# EAGLE board Power_Supply (EAGLE 6.5.0), part 1 of 2
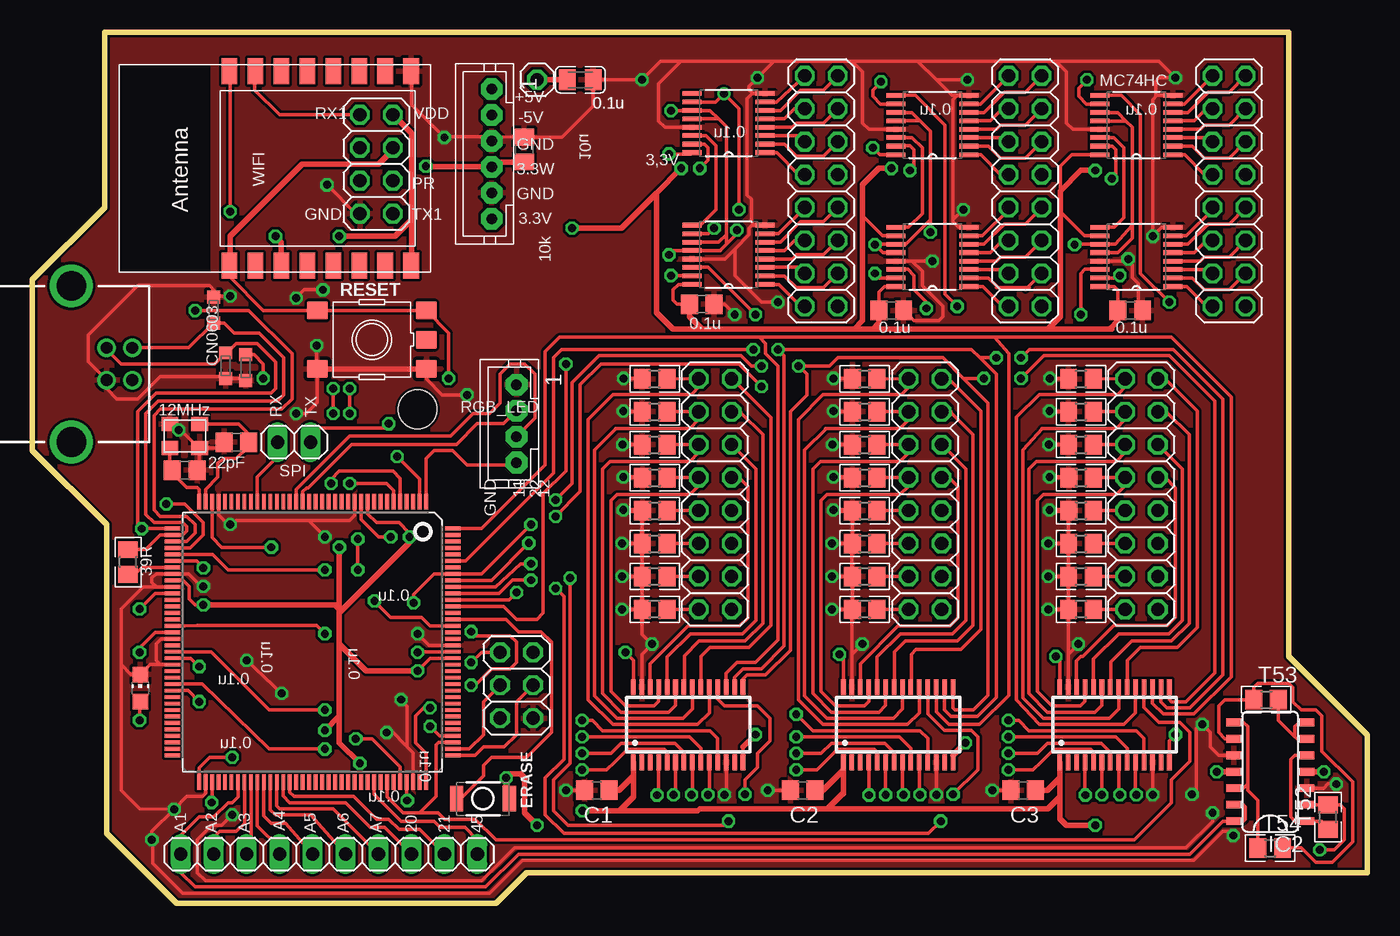
[diagram p5: board, top side]
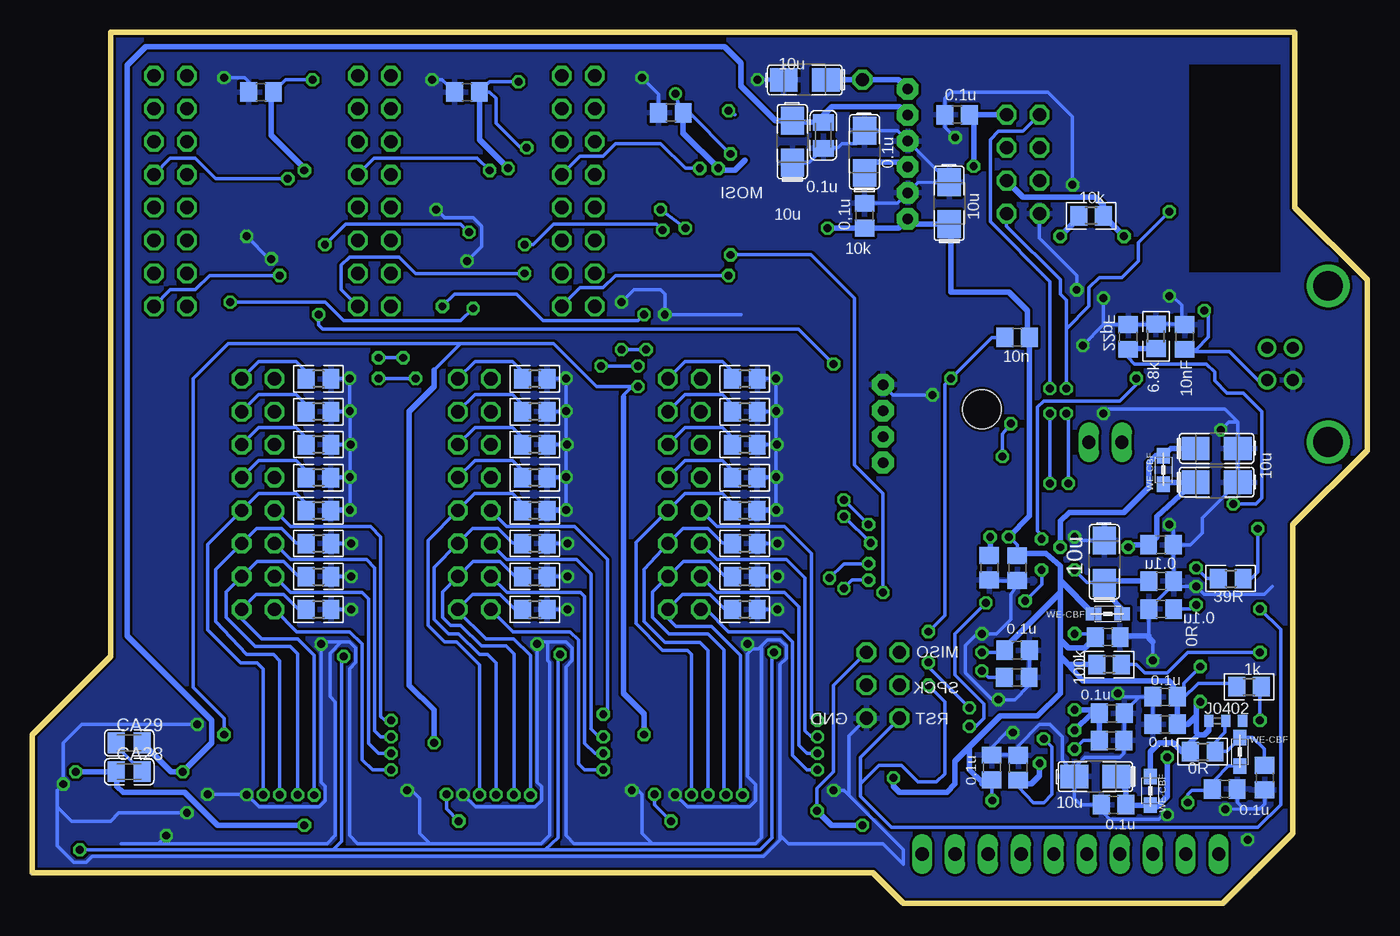
[diagram p6: board, bottom side, seen from below]

Size 102.87 x 67.15 mm. Coordinates in mm from the lower left corner, seen from the top.
Outline: 96.84,67.15 5.56,67.15 5.56,53.66 0,48.1 0,34.92 5.71,29.21 5.71,5.4 11.11,0 35.72,0 38.1,2.38 102.87,2.38 102.87,13.02 96.84,19.05 96.84,67.15
Copper layers (1*16): Top 0.035mm / dielectric 1.6mm / Bottom 0.035mm
Design rules "default *": minimum track width 10mil, minimum drill 24mil, track to track 8mil, track to pad 8mil, pad to pad 8mil, via to via 8mil, smd to smd 8mil, copper to edge 8mil, drill to drill 8mil, minimum pad ring 10mil, minimum via ring 8mil, stop-mask expansion 4mil, vias tented up to drill 0mil, thermal gap 10mil
Net classes: 1 USB: width 0.203 mm, drill 0.254 mm, clearance 0.203 mm; 2 gnd1: width 0.203 mm, drill 0.254 mm, clearance 0.203 mm; 3 usbvcc: width 0.203 mm, drill 0.254 mm, clearance 0.203 mm; 4 USBpair: width 0.203 mm, drill 0.254 mm, clearance 0.203 mm; 5 UA1: width 0.127 mm, drill 0.254 mm, clearance 0.127 mm
Holes 3 mm at 29.69,38.1

## Footprints (pad centres in the part's own frame; a part is rotated, then mirrored left to right if it is on the bottom)
J0402 = smd 0.7 x 0.9: 1 -0.65,0; 2 0.65,0; 3 1.95,0
C0805 = smd 1.3 x 1.5: 1 -0.95,0; 2 0.95,0
B/3528-21W = smd 2.15 x 1.8: + 1.625,0; - -1.625,0
C0805K = smd 1.3 x 1.6: 1 -1,0; 2 1,0
SMD_157SW = smd 1.016 x 1.981: 1 -2.032,0; 2 2.032,0
SO014 = smd 0.6 x 1.2: 1 -3.175,-2.8; 2 -1.905,-2.8; 3 -0.635,-2.8; 4 0.635,-2.8; 5 1.905,-2.8; 6 3.175,-2.8; 7 4.445,-2.8; 8 4.445,2.8; 9 3.175,2.8; 10 1.905,2.8; 11 0.635,2.8; 12 -0.635,2.8; 13 -1.905,2.8; 14 -3.175,2.8
2X08 = drill 1.016 octagon: 1 -8.89,-1.27; 2 -8.89,1.27; 3 -6.35,-1.27; 4 -6.35,1.27; 5 -3.81,-1.27; 6 -3.81,1.27; 7 -1.27,-1.27; 8 -1.27,1.27; 9 1.27,-1.27; 10 1.27,1.27; 11 3.81,-1.27; 12 3.81,1.27; 13 6.35,-1.27; 14 6.35,1.27; 15 8.89,-1.27; 16 8.89,1.27
1X10 = drill 1.016 long: 1 -11.43,0; 2 -8.89,0; 3 -6.35,0; 4 -3.81,0; 5 -1.27,0; 6 1.27,0; 7 3.81,0; 8 6.35,0; 9 8.89,0; 10 11.43,0
1X02 = drill 1.016 long: 1 -1.27,0; 2 1.27,0
2X03 = drill 1.016 octagon: 1 -2.54,-1.27; 2 -2.54,1.27; 3 0,-1.27; 4 0,1.27; 5 2.54,-1.27; 6 2.54,1.27
1X01 = drill 1.016 octagon: 1 0,0
2X04 = drill 1.016 octagon: 1 -3.81,-1.27; 2 -3.81,1.27; 3 -1.27,-1.27; 4 -1.27,1.27; 5 1.27,-1.27; 6 1.27,1.27; 7 3.81,-1.27; 8 3.81,1.27
0805 = smd 1.2 x 1: 1 -1.1,0; 2 1.1,0
CHIP-LED0805 = smd 1.2 x 1.2: A 0,-1.05; C 0,1.05
JST-PH6 = drill 0.813 pad 1.676 octagon: 1 5,0; 2 3,0; 3 1,0; 4 -1,0; 5 -3,0; 6 -5,0
JST-PH4 = drill 0.813 pad 1.676 octagon: 1 3,0; 2 1,0; 3 -1,0; 4 -3,0
R0805 = smd 1.3 x 1.5: 1 -0.95,0; 2 0.95,0
TS42 = smd 1.6 x 1.4: 1 -4.2,2.25; 2 4.2,2.25; 3 -4.2,-2.25; 4 4.2,-2.25; 5 -4.2,0
SOP65P640X120-16N = smd 1.473 x 0.356: 1 -2.819,2.286; 2 -2.819,1.626; 3 -2.819,0.965; 4 -2.819,0.33; 5 -2.819,-0.33; 6 -2.819,-0.965; 7 -2.819,-1.626; 8 -2.819,-2.286; 9 2.819,-2.286; 10 2.819,-1.626; 11 2.819,-0.965; 12 2.819,-0.33; 13 2.819,0.33; 14 2.819,0.965; 15 2.819,1.626; 16 2.819,2.286
LQFP144 = smd 0.3 x 1.2: 1 -8.75,-10.8; 2 -8.25,-10.8; 3 -7.75,-10.8; 4 -7.25,-10.8; 5 -6.75,-10.8; 6 -6.25,-10.8; 7 -5.75,-10.8; 8 -5.25,-10.8; 9 -4.75,-10.8; 10 -4.25,-10.8; 11 -3.75,-10.8; 12 -3.25,-10.8; 13 -2.75,-10.8; 14 -2.25,-10.8; 15 -1.75,-10.8; 16 -1.25,-10.8; 17 -0.75,-10.8; 18 -0.25,-10.8; 19 0.25,-10.8; 20 0.75,-10.8; 21 1.25,-10.8; 22 1.75,-10.8; 23 2.25,-10.8; 24 2.75,-10.8; 25 3.25,-10.8; 26 3.75,-10.8; 27 4.25,-10.8; 28 4.75,-10.8; 29 5.25,-10.8; 30 5.75,-10.8; 31 6.25,-10.8; 32 6.75,-10.8; 33 7.25,-10.8; 34 7.75,-10.8; 35 8.25,-10.8; 36 8.75,-10.8; 73 8.75,10.8; 74 8.25,10.8; 75 7.75,10.8; 76 7.25,10.8; 77 6.75,10.8; 78 6.25,10.8; 79 5.75,10.8; 80 5.25,10.8; 81 4.75,10.8; 82 4.25,10.8; 83 3.75,10.8; 84 3.25,10.8; 85 2.75,10.8; 86 2.25,10.8; 87 1.75,10.8; 88 1.25,10.8; 89 0.75,10.8; 90 0.25,10.8; 91 -0.25,10.8; 92 -0.75,10.8; 93 -1.25,10.8; 94 -1.75,10.8; 95 -2.25,10.8; 96 -2.75,10.8; 97 -3.25,10.8; 98 -3.75,10.8; 99 -4.25,10.8; 100 -4.75,10.8; 101 -5.25,10.8; 102 -5.75,10.8; 103 -6.25,10.8; 104 -6.75,10.8; 105 -7.25,10.8; 106 -7.75,10.8; 107 -8.25,10.8; 108 -8.75,10.8 | smd 1.2 x 0.3: 37 10.8,-8.75; 38 10.8,-8.25; 39 10.8,-7.75; 40 10.8,-7.25; 41 10.8,-6.75; 42 10.8,-6.25; 43 10.8,-5.75; 44 10.8,-5.25; 45 10.8,-4.75; 46 10.8,-4.25; 47 10.8,-3.75; 48 10.8,-3.25; 49 10.8,-2.75; 50 10.8,-2.25; 51 10.8,-1.75; 52 10.8,-1.25; 53 10.8,-0.75; 54 10.8,-0.25; 55 10.8,0.25; 56 10.8,0.75; 57 10.8,1.25; 58 10.8,1.75; 59 10.8,2.25; 60 10.8,2.75; 61 10.8,3.25; 62 10.8,3.75; 63 10.8,4.25; 64 10.8,4.75; 65 10.8,5.25; 66 10.8,5.75; 67 10.8,6.25; 68 10.8,6.75; 69 10.8,7.25; 70 10.8,7.75; 71 10.8,8.25; 72 10.8,8.75; 109 -10.8,8.75; 110 -10.8,8.25; 111 -10.8,7.75; 112 -10.8,7.25; 113 -10.8,6.75; 114 -10.8,6.25; 115 -10.8,5.75; 116 -10.8,5.25; 117 -10.8,4.75; 118 -10.8,4.25; 119 -10.8,3.75; 120 -10.8,3.25; 121 -10.8,2.75; 122 -10.8,2.25; 123 -10.8,1.75; 124 -10.8,1.25; 125 -10.8,0.75; 126 -10.8,0.25; 127 -10.8,-0.25; 128 -10.8,-0.75; 129 -10.8,-1.25; 130 -10.8,-1.75; 131 -10.8,-2.25; 132 -10.8,-2.75; 133 -10.8,-3.25; 134 -10.8,-3.75; 135 -10.8,-4.25; 136 -10.8,-4.75; 137 -10.8,-5.25; 138 -10.8,-5.75; 139 -10.8,-6.25; 140 -10.8,-6.75; 141 -10.8,-7.25; 142 -10.8,-7.75; 143 -10.8,-8.25; 144 -10.8,-8.75
TSSOP28 = smd 0.35 x 1.2: 1 -4.225,-2.9; 2 -3.575,-2.9; 3 -2.925,-2.9; 4 -2.275,-2.9; 5 -1.625,-2.9; 6 -0.975,-2.9; 7 -0.325,-2.9; 8 0.325,-2.9; 9 0.975,-2.9; 10 1.625,-2.9; 11 2.275,-2.9; 12 2.925,-2.9; 13 3.575,-2.9; 14 4.225,-2.9; 15 4.225,2.9; 16 3.575,2.9; 17 2.925,2.9; 18 2.275,2.9; 19 1.625,2.9; 20 0.975,2.9; 21 0.325,2.9; 22 -0.325,2.9; 23 -0.975,2.9; 24 -1.625,2.9; 25 -2.275,2.9; 26 -2.925,2.9; 27 -3.575,2.9; 28 -4.225,2.9
ESP-12 = smd 2 x 1.2: 1 -7.5,4.5; 2 -7.5,2.5; 3 -7.5,0.5; 4 -7.5,-1.5; 5 -7.5,-3.5; 6 -7.5,-5.5; 7 -7.5,-7.5; 8 -7.5,-9.5; 9 7.5,-9.5; 10 7.5,-7.5; 11 7.5,-5.5; 12 7.5,-3.5; 13 7.5,-1.5; 14 7.5,0.5; 15 7.5,2.5; 16 7.5,4.5
USB-B-PTH = drill 0.914: D+ 0,1.25; D- 1.981,1.25; GND 0,-1.25; VBUS 1.981,-1.25 | drill 2.286: P$1 -2.718,-6.02; P$2 -2.718,6.02
CRYSTAL-3.2-2.5 = smd 1.3 x 1.05: 1 -1.15,-0.925; 2 1.15,-0.925; 3 1.15,0.925; 4 -1.15,0.925
CT/CN0603 = smd 1 x 1: 1 -1,0; 2 1,0

## Placement (x,y rotation side)
BR1  NM  [J0402]  10.25,14.08 180 bottom
C1  [C0805]  43.5,8.73 180 top
C2  [C0805]  59.37,8.73 180 top
C3  [C0805]  76.36,8.73 180 top
C4  [C0805]  84.61,45.72 0 top
C5  [C0805]  85.25,62.55 180 bottom
C6  [C0805]  66.2,45.72 0 top
C7  0.1uF  [C0805]  69.37,62.55 180 bottom
C8  [C0805]  51.59,46.2 0 top
C9  [C0805]  53.66,60.96 180 bottom
CA1  0,1u  [C0805]  38.73,53.02 90 bottom
CA2  10u  [B/3528-21W]  32.2,53.99 270 bottom
CA3  100n  [C0805]  28.92,10.49 90 bottom
CA4  100n  [C0805]  15.57,15.94 180 bottom
CA5  100n  [C0805]  15.57,13.81 180 bottom
CA6  100n  [C0805]  19.99,20.54 0 bottom
CA7  100n  [C0805]  37.91,58.12 90 top
CA8  100n  [C0805]  26.96,25.86 270 bottom
CA9  100n  [C0805]  26.99,19.53 0 bottom
CA10  100n  [C0805]  15.86,24.86 0 bottom
CA11  10u  [B/3528-21W]  20.24,26.35 270 bottom
CA12  100n  [C0805]  19.54,7.62 180 bottom
CA13  10u  [B/3528-21W]  20.95,9.79 0 bottom
CA14  10u  [B/3528-21W]  11.6,35.07 180 bottom
CA15  100n  [C0805]  19.67,14.67 0 bottom
CA16  100n  [C0805]  19.7,12.57 0 bottom
CA17  100n  [C0805]  29.11,25.89 270 bottom
CA18  100n  [C0805]  15.86,22.7 180 bottom
CA19  100n  [C0805]  26.89,10.46 90 bottom
CA20  100n  [C0805]  27,17.43 0 bottom
CA21  10n  [C0805]  26.97,43.64 180 bottom
CA22  100n  [C0805]  7.89,9.7 270 bottom
CA23  100n  [C0805]  10.97,8.83 0 bottom
CA24  22p  [C0805]  11.73,33.4 0 top
CA25  22pF  [C0805]  15.73,35.56 180 top
CA26  100n  [C0805]  15.89,27.65 0 bottom
CA27  10u  [B/3528-21W]  11.6,32.47 180 bottom
CA28  0.1u  [C0805K]  95.41,10.16 0 bottom
CA29  0.1u  [C0805K]  95.41,12.38 0 bottom
CA35  22p  [C0805]  18.41,43.67 90 bottom
CA36  10n  [C0805]  14.07,43.67 90 bottom
CA37  10uF  [B/3528-21W]  43.34,63.5 0 bottom
CA38  100n  [C0805]  31.59,60.8 180 bottom
CA49  10u  [B/3528-21W]  38.73,57.94 270 bottom
CA50  10uF  [B/3528-21W]  44.29,58.74 270 bottom
CA51  0.1u  [C0805K]  41.91,59.21 270 bottom
CA54  0.1u  [C0805K]  42.23,63.5 0 top
ERASE  [SMD_157SW]  34.72,8.08 180 top
IC2  LMV324  [SO014]  95.41,9.52 90 top
JP4  [2X08]  92.23,54.93 90 top
JP5  [2X08]  76.52,54.93 90 top
JP6  [2X08]  60.8,54.93 90 top
JP7  [1X10]  22.86,3.81 0 top
JP8  [1X02]  20.16,35.56 0 top
JP9  [2X03]  37.31,16.83 270 top
JP10  [1X01]  38.89,63.5 0 top
JP11  [2X04]  26.51,56.99 270 top
JPP1  [2X08]  52.62,31.56 90 top
JPP2  [2X08]  68.81,31.56 90 top
JPP3  [2X08]  85.48,31.56 90 top
L1  MH2029-300Y  [0805]  16.72,8.68 270 bottom
L2  MH2029-300Y  [0805]  19.98,22.33 0 bottom
L3  MH2029-300Y  [0805]  9.82,11.7 270 bottom
L5  MH2029-300Y  [0805]  15.69,33.43 270 bottom
ON  GREEN  [CHIP-LED0805]  8.32,16.61 0 top
P2  [JST-PH6]  35.4,57.79 90 top
P4  [JST-PH4]  37.31,36.99 90 top
RA3  1k  [R0805]  9.09,16.7 0 bottom
RA4  0R  [R0805]  12.67,11.7 0 bottom
RA5  100k  [R0805]  19.89,18.41 180 bottom
RA7  39R 1%  [R0805]  7.38,26.32 90 top
RA8  39R 1%  [R0805]  10.51,25.06 0 bottom
RA9  6K8 1%  [R0805]  16.26,43.72 90 bottom
RESET  TS42  [TS42]  26.16,43.47 180 top
RF4  10k  [R0805]  21.27,53.02 180 bottom
T1  [R0805]  47.95,40.44 0 top
T2  [R0805]  47.95,40.44 180 bottom
T3  [R0805]  47.95,37.91 0 top
T4  [R0805]  47.95,37.91 180 bottom
T5  [R0805]  47.95,35.38 180 bottom
T6  [R0805]  47.96,32.83 180 bottom
T7  [R0805]  47.96,30.28 180 bottom
T8  [R0805]  47.95,27.75 0 top
T10  [R0805]  47.95,25.21 180 top
T11  [R0805]  47.95,25.21 0 bottom
T12  [R0805]  47.95,22.67 180 top
T13  [R0805]  47.95,22.67 0 bottom
T14  [R0805]  47.95,35.38 0 top
T15  [R0805]  47.96,32.83 0 top
T16  [R0805]  47.96,30.28 0 top
T17  [R0805]  47.95,27.75 180 bottom
T18  [R0805]  64.15,40.44 0 top
T19  [R0805]  64.15,40.44 180 bottom
T20  [R0805]  64.15,37.91 0 top
T21  [R0805]  64.15,37.91 180 bottom
T22  [R0805]  64.15,35.38 0 top
T23  [R0805]  64.16,32.83 0 top
T24  [R0805]  64.16,30.28 0 top
T25  [R0805]  64.15,27.75 0 top
T26  [R0805]  64.15,25.21 180 top
T27  [R0805]  64.15,25.21 0 bottom
T28  [R0805]  64.15,22.67 180 top
T29  [R0805]  64.15,22.67 0 bottom
T30  [R0805]  64.15,35.38 180 bottom
T31  [R0805]  64.16,32.83 180 bottom
T32  [R0805]  64.16,30.28 180 bottom
T33  [R0805]  64.15,27.75 180 bottom
T34  [R0805]  80.81,40.44 0 top
T35  [R0805]  80.81,40.44 180 bottom
T36  [R0805]  80.81,37.91 0 top
T37  [R0805]  80.81,37.91 180 bottom
T38  [R0805]  80.81,35.38 180 bottom
T39  [R0805]  80.82,32.83 0 top
T40  [R0805]  80.82,30.28 0 top
T41  [R0805]  80.81,27.75 0 top
T42  [R0805]  80.81,25.21 180 top
T43  [R0805]  80.81,25.21 0 bottom
T44  [R0805]  80.81,22.67 180 top
T45  [R0805]  80.81,22.67 0 bottom
T46  [R0805]  80.81,35.38 0 top
T47  [R0805]  80.82,32.83 180 bottom
T48  [R0805]  80.82,30.28 180 bottom
T49  [R0805]  80.81,27.75 180 bottom
T52  [R0805]  99.85,6.67 90 top
T53  [R0805]  95.09,15.72 0 top
T54  [R0805]  95.41,4.29 0 top
U4  MC74HC595ADTR2G  [SOP65P640X120-16N]  85.09,49.85 180 top
U5  MC74HC595ADTR2G  [SOP65P640X120-16N]  85.09,60.01 180 top
U6  MC74HC595ADTR2G  [SOP65P640X120-16N]  69.37,49.85 180 top
U7  MC74HC595ADTR2G  [SOP65P640X120-16N]  69.37,60.01 180 top
U8  MC74HC595ADTR2G  [SOP65P640X120-16N]  53.66,50.01 180 top
U9  MC74HC595ADTR2G  [SOP65P640X120-16N]  53.66,60.17 180 top
UA1  ATSAM3X8EA-AU  [LQFP144]  21.59,20.16 180 top
UU1  ADG706BRU  [TSSOP28]  50.54,13.78 0 top
UU2  ADG706BRU  [TSSOP28]  66.73,13.78 0 top
UU3  ADG706BRU  [TSSOP28]  83.4,13.78 0 top
X1  [ESP-12]  19.69,56.67 90 top
X3  USBPTH  [USB-B-PTH]  5.71,41.59 0 top
Y1  12MHz KX-7 20pF  [CRYSTAL-3.2-2.5]  11.75,36.04 0 top
Z1  CG0603MLC-05E  [CT/CN0603]  14.91,41.45 270 top
Z2  CG0603MLC-05E  [CT/CN0603]  13.96,45.75 90 top
Z5  CG0603MLC-05E  [CT/CN0603]  16.42,41.3 90 top